# Altium schematic sheet contactor-feedback.SchDoc
size A3; DocumentNumber: 16; SheetNumber: 16; SheetTotal: 45; SheetDescription: Contactor Feedback
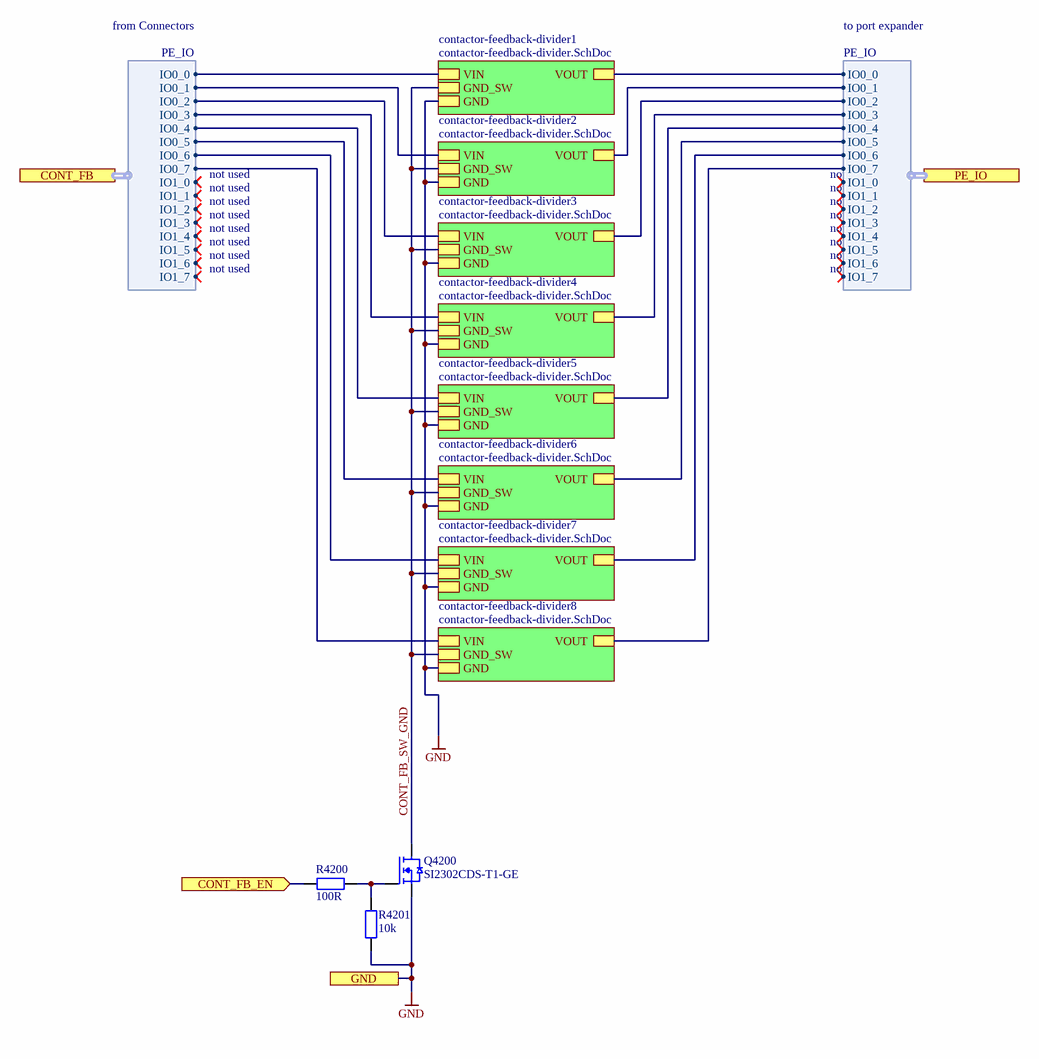
[diagram p0: contactor-feedback.SchDoc]

## Parts
Q4200  SI2302CDS-T1-GE  [SOT95P237X112-3N]
R4200  100R  [RESC1005X04N]
R4201  10k  [RESC1005X04N]

## Sub-sheets
contactor-feedback-divider1 = contactor-feedback-divider.SchDoc: GND, VOUT, VIN, GND_SW
contactor-feedback-divider2 = contactor-feedback-divider.SchDoc: GND, VOUT, VIN, GND_SW
contactor-feedback-divider3 = contactor-feedback-divider.SchDoc: GND, VOUT, VIN, GND_SW
contactor-feedback-divider4 = contactor-feedback-divider.SchDoc: GND, VOUT, VIN, GND_SW
contactor-feedback-divider5 = contactor-feedback-divider.SchDoc: GND, VOUT, VIN, GND_SW
contactor-feedback-divider6 = contactor-feedback-divider.SchDoc: GND, VOUT, VIN, GND_SW
contactor-feedback-divider7 = contactor-feedback-divider.SchDoc: GND, VOUT, VIN, GND_SW
contactor-feedback-divider8 = contactor-feedback-divider.SchDoc: GND, VOUT, VIN, GND_SW

## Ports
CONT_FB (harness PE_IO), CONT_FB_EN (in), GND, PE_IO (harness PE_IO)

## Harnesses
PE_IO: IO0_0, IO0_1, IO0_2, IO0_3, IO0_4, IO0_5, IO0_6, IO0_7, IO1_0, IO1_1, IO1_2, IO1_3, IO1_4, IO1_5, IO1_6, IO1_7

## Nets
GND: Q4200.S R4201.1 ; port GND, sheet contactor-feedback-divider1/GND, sheet contactor-feedback-divider2/GND, sheet contactor-feedback-divider3/GND, sheet contactor-feedback-divider4/GND, sheet contactor-feedback-divider5/GND, sheet contactor-feedback-divider6/GND, sheet contactor-feedback-divider7/GND, sheet contactor-feedback-divider8/GND
CONT_FB_EN: R4200.1 ; port CONT_FB_EN
CONT_FB_SW_GND: Q4200.D ; sheet contactor-feedback-divider1/GND_SW, sheet contactor-feedback-divider2/GND_SW, sheet contactor-feedback-divider3/GND_SW, sheet contactor-feedback-divider4/GND_SW, sheet contactor-feedback-divider5/GND_SW, sheet contactor-feedback-divider6/GND_SW, sheet contactor-feedback-divider7/GND_SW, sheet contactor-feedback-divider8/GND_SW
NetQ4200_G: Q4200.G R4200.2 R4201.2
(unnamed): sheet contactor-feedback-divider1/VOUT, port PE_IO.IO0_0
(unnamed): sheet contactor-feedback-divider1/VIN, port CONT_FB.IO0_0
(unnamed): sheet contactor-feedback-divider2/VOUT, port PE_IO.IO0_1
(unnamed): sheet contactor-feedback-divider2/VIN, port CONT_FB.IO0_1
(unnamed): sheet contactor-feedback-divider3/VOUT, port PE_IO.IO0_2
(unnamed): sheet contactor-feedback-divider3/VIN, port CONT_FB.IO0_2
(unnamed): sheet contactor-feedback-divider4/VOUT, port PE_IO.IO0_3
(unnamed): sheet contactor-feedback-divider4/VIN, port CONT_FB.IO0_3
(unnamed): sheet contactor-feedback-divider5/VOUT, port PE_IO.IO0_4
(unnamed): sheet contactor-feedback-divider5/VIN, port CONT_FB.IO0_4
(unnamed): sheet contactor-feedback-divider6/VOUT, port PE_IO.IO0_5
(unnamed): sheet contactor-feedback-divider6/VIN, port CONT_FB.IO0_5
(unnamed): sheet contactor-feedback-divider7/VOUT, port PE_IO.IO0_6
(unnamed): sheet contactor-feedback-divider7/VIN, port CONT_FB.IO0_6
(unnamed): sheet contactor-feedback-divider8/VOUT, port PE_IO.IO0_7
(unnamed): sheet contactor-feedback-divider8/VIN, port CONT_FB.IO0_7

## Notes on the sheet
- from Connectors
- to port expander
- not used
- Fraunhofer IISB
- Schottkystr. 10
- developed by:
- 91058 Erlangen
- Germany
- Author
- Project
- License
- Description
- File
- Version
- Release Date
- Sheet
- foxbms.org <https://foxbms.org>
- www.iisb.fraunhofer.de <https://www.iisb.fraunhofer.de/>
- foxBMS Team
- /

## Library data of the parts
Q4200 = SI2302CDS-T1-GE: MOSFET, N CHANNEL, 20V, 0.045OHM, 2.6A, TO-236; Manufacturer: Vishay; Maximum Continous Drain Current (25°C): 2.9A; R_DS(on): 60m; Total Gate Charge: 3.5nC; Automotive Qualified: False; Part Number: SI2302CDS-T1-GE; Part Name: NMOS; Operating Temperature: -55°C - +150°C; Maximum Drain-Source Voltage: 20V; ComponentLink1Description: Datasheet; ComponentLink1URL: http://www.farnell.com/datasheets/2046484.pdf?_ga=2.69037521.1386499687.1551691751-810718100.1550587845; Supplier 1: Farnell; Supplier Part Number 1: 2524651; Supplier 2: Mouser; Supplier Part Number 2: 781-SI2302CDS-E3; Supplier 3: Digikey; Supplier Part Number 3: SI2302CDS-T1-E3CT-ND
R4200 = gen_R_100R_0402: SMD Resistor 100R 0402; Tolerance: 1%; Power: 0.063W; Case EIA: 0402; Case Metric: 1005; Maximum Working Voltage: 50V; PnP Package: 0402R; PnP equipped: x; Automotive Qualified: True; AEC-Q Norm: AEC-Q200; Part Number: gen_R_100R_0402; Operating Temperature: -55°C - +155°C; Resistance: 100R; Series: E24, E96; PnP Value: 100R; Supplier 1: Farnell; Supplier Part Number 1: 2302528; ECCN: EAR99
R4201 = gen_R_10k_0402: SMD Resistor 10k 0402; Tolerance: 1%; Power: 0.063W; Case EIA: 0402; Case Metric: 1005; Maximum Working Voltage: 50V; PnP Package: 0402R; PnP equipped: x; Automotive Qualified: True; AEC-Q Norm: AEC-Q200; Part Number: gen_R_10k_0402; Operating Temperature: -55°C - +155°C; Resistance: 10k; Series: E24, E96; PnP Value: 10k; Supplier 1: Farnell; Supplier Part Number 1: 2059239; ECCN: EAR99